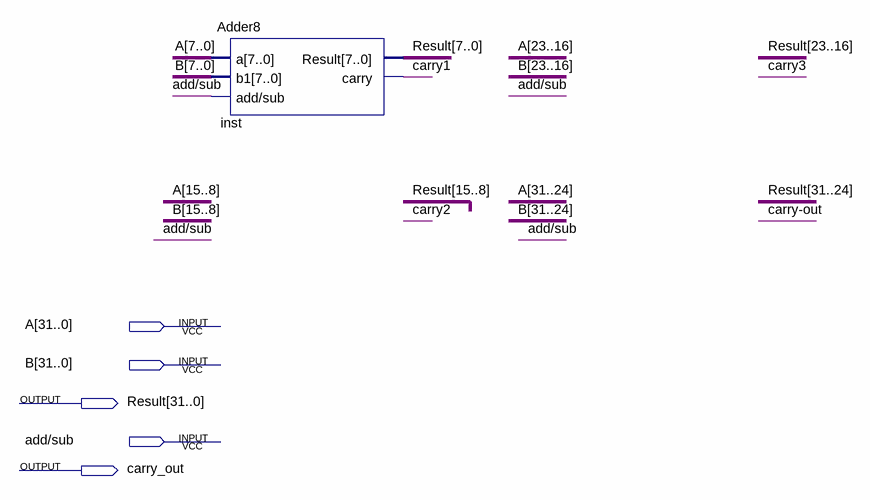
[diagram p0: schematic sheet]
// Quartus schematic AddorSub.bdf as structural Verilog: 1 symbols, 5 pins
module AddorSub (
  input  [31:0] A,
  input  [31:0] B,
  input  \add/sub ,
  output [31:0] Result,
  output carry_out
);

  wire carry1;

  Adder8 inst (.a(A[7:0]), .b1(B[7:0]), .\add/sub (\add/sub ), .Result(Result[7:0]), .carry(carry1));
endmodule
